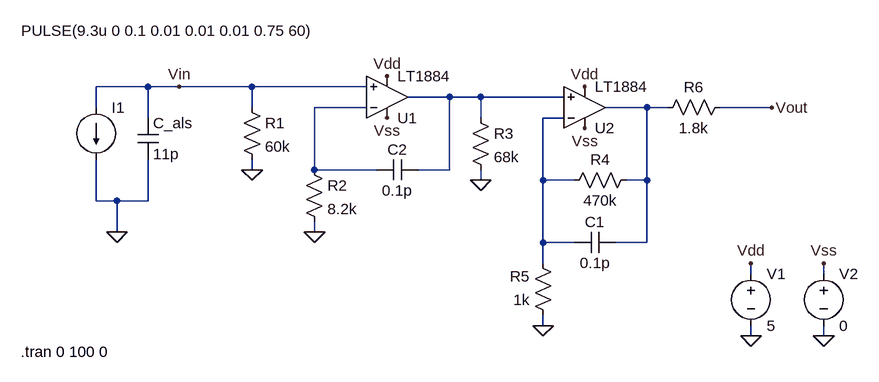
[diagram p0: schematic pulsometer.asc]
pulsometer.asc, the LTspice schematic file:
Version 4
SHEET 1 880 680
WIRE -352 128 -432 128
WIRE -304 128 -352 128
WIRE -192 128 -304 128
WIRE -16 128 -192 128
WIRE 112 144 48 144
WIRE 160 144 112 144
WIRE 288 144 160 144
WIRE -432 160 -432 128
WIRE -192 160 -192 128
WIRE -16 160 -96 160
WIRE 416 160 352 160
WIRE 448 160 416 160
WIRE 608 160 528 160
WIRE -352 176 -352 128
WIRE 160 176 160 144
WIRE 288 176 256 176
WIRE -192 256 -192 240
WIRE -96 256 -96 160
WIRE 0 256 -96 256
WIRE 112 256 112 144
WIRE 112 256 64 256
WIRE 160 272 160 256
WIRE 256 272 256 176
WIRE 304 272 256 272
WIRE 416 272 416 160
WIRE 416 272 384 272
WIRE -432 304 -432 240
WIRE -400 304 -432 304
WIRE -352 304 -352 240
WIRE -352 304 -400 304
WIRE -400 352 -400 304
WIRE -96 352 -96 336
WIRE 256 368 256 272
WIRE 304 368 256 368
WIRE 416 368 416 272
WIRE 416 368 368 368
WIRE 256 400 256 368
WIRE 576 416 576 400
WIRE 688 416 688 400
WIRE 256 496 256 480
WIRE 576 512 576 496
WIRE 688 512 688 496
FLAG -192 256 0
FLAG -96 352 0
FLAG 160 272 0
FLAG 256 496 0
FLAG 16 112 Vdd
FLAG 320 128 Vdd
FLAG 576 400 Vdd
FLAG 320 192 Vss
FLAG 16 176 Vss
FLAG 688 400 Vss
FLAG 576 512 0
FLAG 688 512 0
FLAG 608 160 Vout
FLAG -304 128 Vin
FLAG -400 352 0
SYMBOL OpAmps\\LT1884 16 208 M180
SYMATTR InstName U1
SYMBOL OpAmps\\LT1884 320 224 M180
SYMATTR InstName U2
SYMBOL res -208 144 R0
SYMATTR InstName R1
SYMATTR Value 60k
SYMBOL res -112 240 R0
SYMATTR InstName R2
SYMATTR Value 8.2k
SYMBOL res 144 160 R0
SYMATTR InstName R3
SYMATTR Value 68k
SYMBOL res 400 256 R90
WINDOW 0 0 56 VBottom 2
WINDOW 3 32 56 VTop 2
SYMATTR InstName R4
SYMATTR Value 470k
SYMBOL res 272 496 R180
WINDOW 0 36 76 Left 2
WINDOW 3 36 40 Left 2
SYMATTR InstName R5
SYMATTR Value 1k
SYMBOL res 432 176 R270
WINDOW 0 32 56 VTop 2
WINDOW 3 0 56 VBottom 2
SYMATTR InstName R6
SYMATTR Value 1.8k
SYMBOL cap 368 352 R90
WINDOW 0 0 32 VBottom 2
WINDOW 3 32 32 VTop 2
SYMATTR InstName C1
SYMATTR Value 0.1p
SYMBOL voltage 576 400 R0
WINDOW 123 0 0 Left 0
WINDOW 39 0 0 Left 0
SYMATTR InstName V1
SYMATTR Value 5
SYMBOL voltage 688 400 R0
WINDOW 123 0 0 Left 0
WINDOW 39 0 0 Left 0
SYMATTR InstName V2
SYMATTR Value 0
SYMBOL current -432 160 R0
WINDOW 123 0 0 Left 0
WINDOW 39 0 0 Left 0
WINDOW 3 -115 -118 Left 2
SYMATTR InstName I1
SYMATTR Value PULSE(9.3u 0 0.1 0.01 0.01 0.01 0.75 60)
SYMBOL cap -368 176 R0
SYMATTR InstName C_als
SYMATTR Value 11p
SYMBOL cap 64 240 R90
WINDOW 0 0 32 VBottom 2
WINDOW 3 32 32 VTop 2
SYMATTR InstName C2
SYMATTR Value 0.1p
TEXT -548 536 Left 2 !.tran 0 100 0

The netlist it stands for:
* pulsometer.asc
XU1 Vin N002 Vss Vdd N001 LT1884  ; pins In+ In- V+ V- OUT
XU2 N001 N004 Vss Vdd N003 LT1884  ; pins In+ In- V+ V- OUT
R1 Vin 0 60k
R2 N002 0 8.2k
R3 N001 0 68k
R4 N003 N004 470k
R5 0 N004 1k
R6 N003 Vout 1.8k
C1 N003 N004 0.1p
V1 Vdd 0 5
V2 Vss 0 0
I1 Vin 0 PULSE(9.3u 0 0.1 0.01 0.01 0.01 0.75 60)
C_als Vin 0 11p
C2 N001 N002 0.1p
.tran 0 100 0
.backanno
.end